# Altium schematic sheet mcu.SchDoc
size A3; SheetNumber: 2; SheetTotal: 8
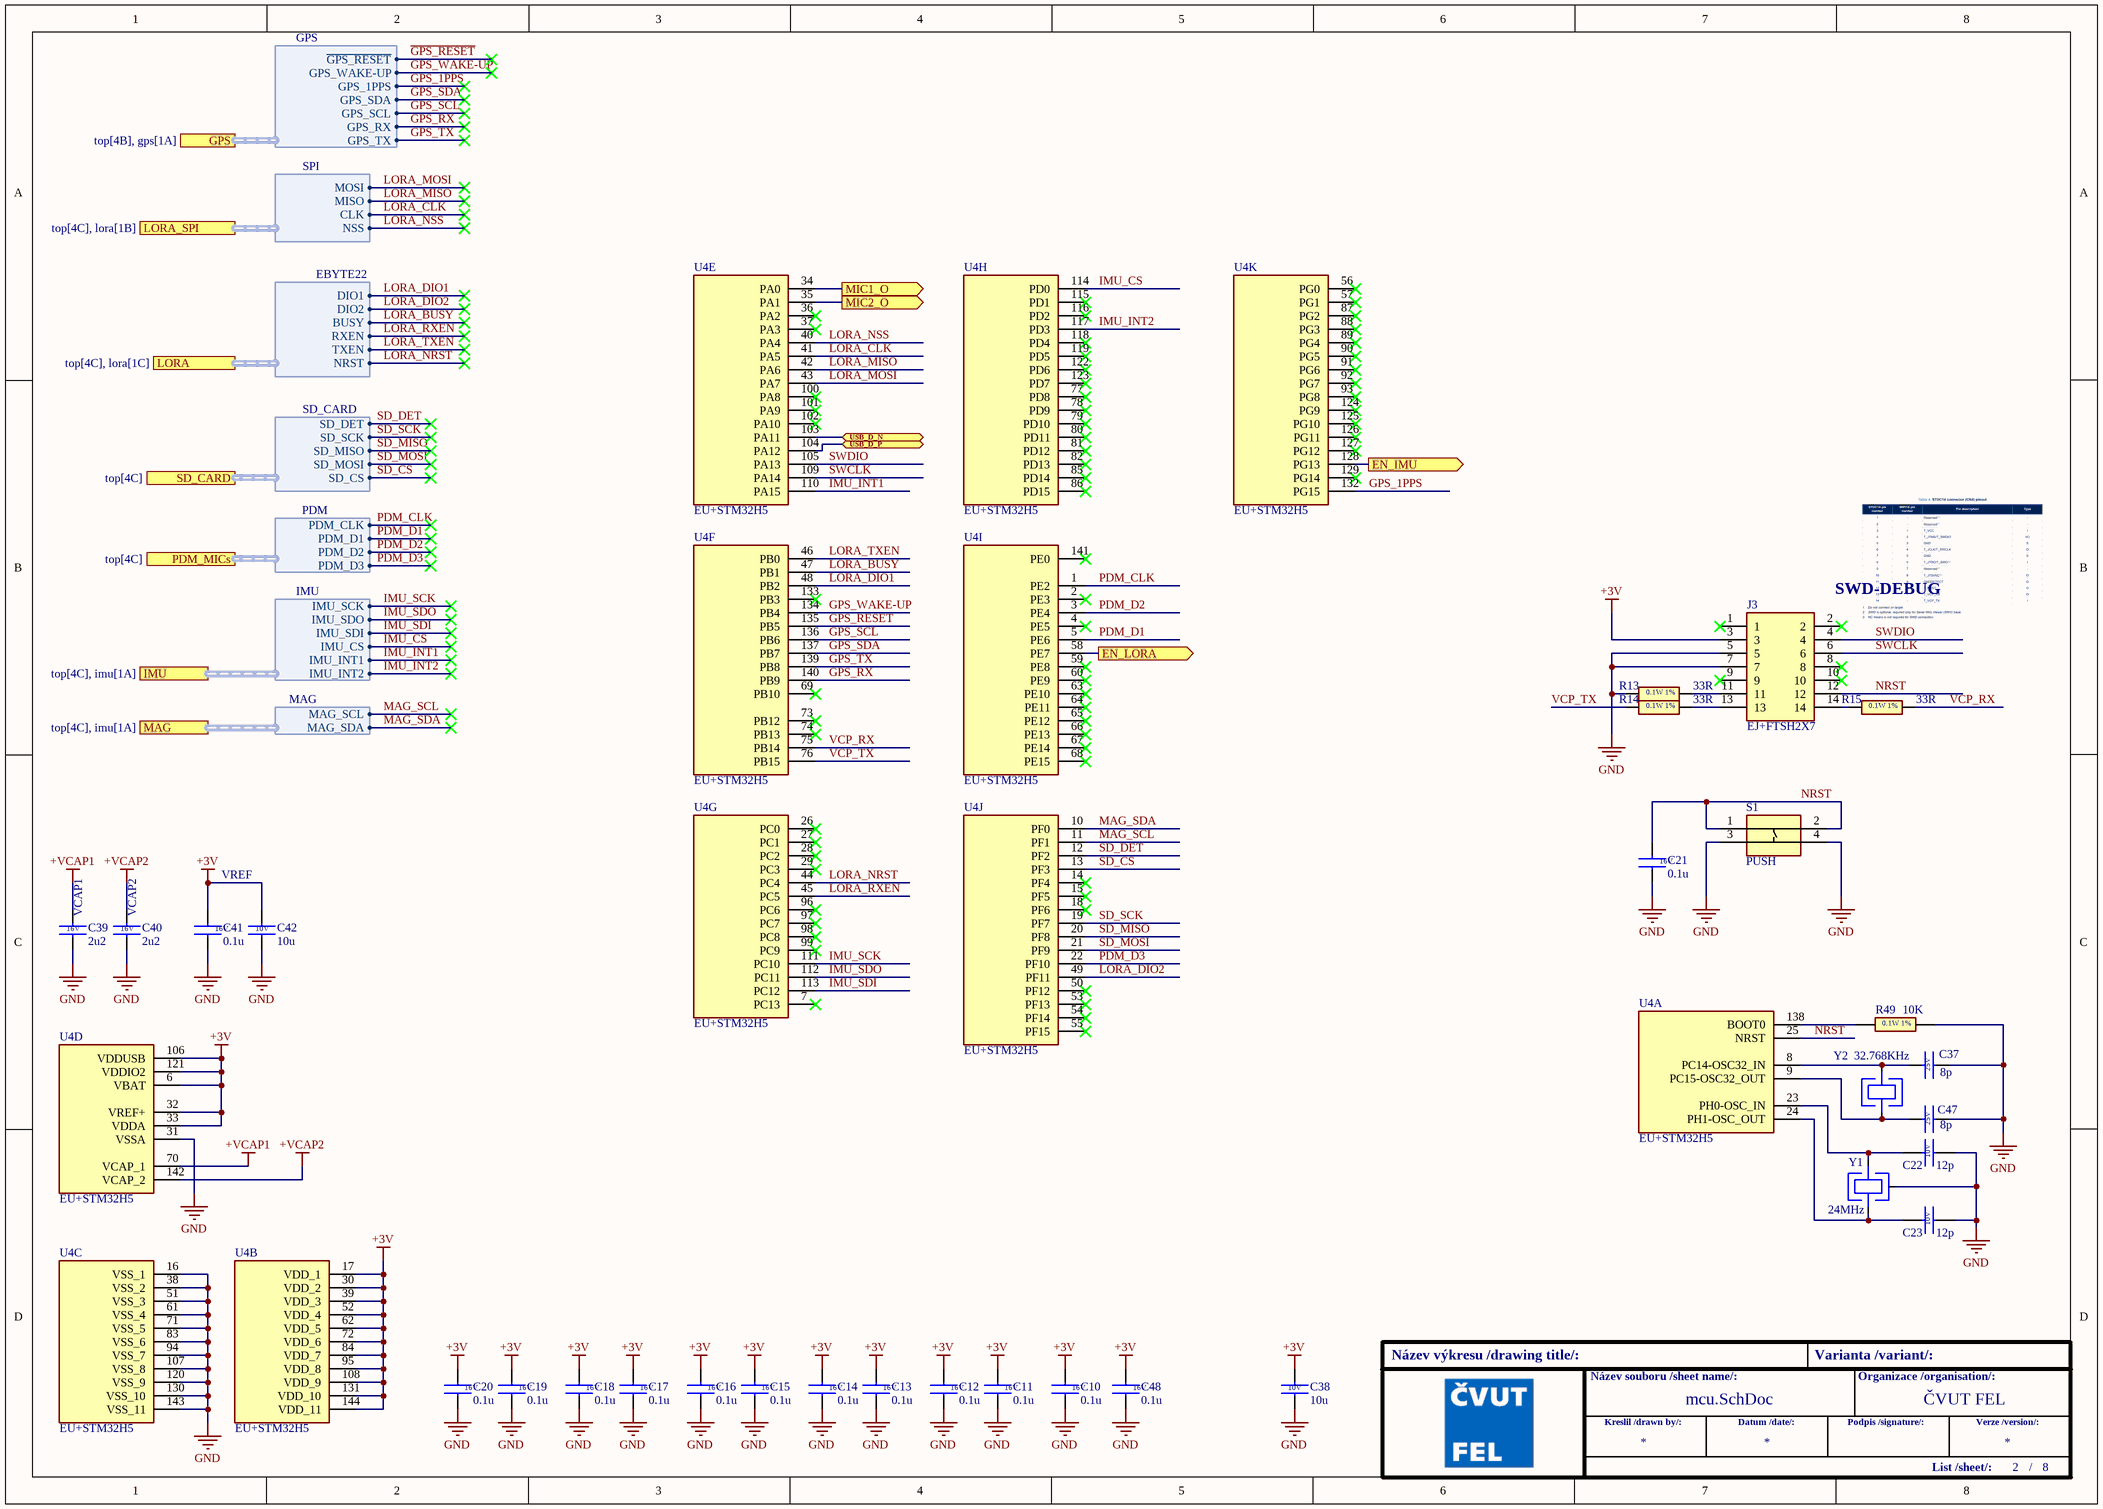
[diagram p0: mcu.SchDoc]

## Parts
C10  0.1u  [CAPC1608X95N]
C11  0.1u  [CAPC1608X95N]
C12  0.1u  [CAPC1608X95N]
C13  0.1u  [CAPC1608X95N]
C14  0.1u  [CAPC1608X95N]
C15  0.1u  [CAPC1608X95N]
C16  0.1u  [CAPC1608X95N]
C17  0.1u  [CAPC1608X95N]
C18  0.1u  [CAPC1608X95N]
C19  0.1u  [CAPC1608X95N]
C20  0.1u  [CAPC1608X95N]
C21  0.1u  [CAPC1608X95N]
C22  12p  [CAPC1608X97N]
C23  12p  [CAPC1608X97N]
C37  8p  [CBR04C160F5GAC]
C38  10u  [C0603]
C39  2u2  [CAPC1608X90N]
C40  2u2  [CAPC1608X90N]
C41  0.1u  [CAPC1608X95N]
C42  10u  [C0603]
C47  8p  [CBR04C160F5GAC]
C48  0.1u  [CAPC1608X95N]
J3  EJ+FTSH2X7  [FTSH-107-XX-YYY-DV-K-A-P]
R13  33R  [RESC1608X55N]
R14  33R  [RESC1608X55N]
R15  33R  [RESC1608X55N]
R49  10K  [RESC1608X50N]
S1  PUSH  [RKB2SJM250SMTRLFS]
U4  EU+STM32H5  [QFP50P2200X2200X160-144N]  (parts A,B,C,D,E,F,G,H,I,J,K of 11)
Y1  24MHz  [830107006509]
Y2  32.768KHz  [830009709]

## Ports
EN_IMU (out, see top[4B], power[3B]), EN_LORA (out, see top[4B], power[3A]), GPS (harness GPS, see top[4B], gps[1A]), IMU (harness IMU, see top[4C], imu[1A]), LORA (harness EBYTE22, see top[4C], lora[1C]), LORA_SPI (harness SPI, see top[4C], lora[1B]), MAG (harness MAG, see top[4C], imu[1A]), MIC1_O (out, see top[4C], analog_mics[3B]), MIC2_O (out, see top[4C], analog_mics[3C]), PDM_MICs (harness PDM, see top[4C]), SD_CARD (harness SD_CARD, see top[4C]), USB_D_N (bidir, see top[4B]), USB_D_P (bidir, see top[4B])

## Harnesses
SPI: MOSI, MISO, CLK, NSS
EBYTE22: BUSY, RXEN, TXEN, NRST, DIO2, DIO1
GPS: GPS_TX, GPS_RX, GPS_SCL, GPS_SDA, GPS_1PPS, GPS_WAKE-UP, ~{GPS_RESET}
SD_CARD: SD_CS, SD_MOSI, SD_SCK, SD_DET, SD_MISO
PDM: PDM_D3, PDM_D2, PDM_D1, PDM_CLK
IMU: IMU_INT2, IMU_INT1, IMU_CS, IMU_SDI, IMU_SDO, IMU_SCK
MAG: MAG_SCL, MAG_SDA

## Nets
+3V: C10.1 C11.1 C12.1 C13.1 C14.1 C15.1 C16.1 C17.1 C18.1 C19.1 C20.1 C38.1 C41.1 C42.1 C48.1 J3.3 U4.6(VBAT) U4.17(VDD_1) U4.30(VDD_2) U4.32(VREF+) U4.33(VDDA) U4.39(VDD_3) U4.52(VDD_4) U4.62(VDD_5) U4.72(VDD_6) U4.84(VDD_7) U4.95(VDD_8) U4.106(VDDUSB) U4.108(VDD_9) U4.121(VDDIO2) U4.131(VDD_10) U4.144(VDD_11)
+VCAP1: C39.1 U4.70(VCAP_1)
+VCAP2: C40.1 U4.142(VCAP_2)
GND: C10.2 C11.2 C12.2 C13.2 C14.2 C15.2 C16.2 C17.2 C18.2 C19.2 C20.2 C21.2 C22.2 C23.2 C37.2 C38.2 C39.2 C40.2 C41.2 C42.2 C47.2 C48.2 J3.5 J3.7 R13.1 R49.2 S1.3(COM) S1.4(COM_2) U4.16(VSS_1) U4.31(VSSA) U4.38(VSS_2) U4.51(VSS_3) U4.61(VSS_4) U4.71(VSS_5) U4.83(VSS_6) U4.94(VSS_7) U4.107(VSS_8) U4.120(VSS_9) U4.130(VSS_10) U4.143(VSS_11) Y1.2(GND)
EN_IMU: U4.128(PG13) ; port EN_IMU
EN_LORA: U4.58(PE7) ; port EN_LORA
~{GPS_RESET}: U4.135(PB5) ; port GPS.~{GPS_RESET}
GPS_1PPS: U4.132(PG15) ; port GPS.GPS_1PPS
GPS_RX: U4.140(PB9) ; port GPS.GPS_RX
GPS_SCL: U4.136(PB6) ; port GPS.GPS_SCL
GPS_SDA: U4.137(PB7) ; port GPS.GPS_SDA
GPS_TX: U4.139(PB8) ; port GPS.GPS_TX
GPS_WAKE-UP: U4.134(PB4) ; port GPS.GPS_WAKE-UP
IMU_CS: U4.114(PD0) ; port IMU.IMU_CS
IMU_INT1: U4.110(PA15) ; port IMU.IMU_INT1
IMU_INT2: U4.117(PD3) ; port IMU.IMU_INT2
IMU_SCK: U4.111(PC10) ; port IMU.IMU_SCK
IMU_SDI: U4.113(PC12) ; port IMU.IMU_SDI
IMU_SDO: U4.112(PC11) ; port IMU.IMU_SDO
LORA_BUSY: U4.47(PB1) ; port LORA.BUSY
LORA_CLK: U4.41(PA5) ; port LORA_SPI.CLK
LORA_DIO1: U4.48(PB2) ; port LORA.DIO1
LORA_DIO2: U4.49(PF11) ; port LORA.DIO2
LORA_MISO: U4.42(PA6) ; port LORA_SPI.MISO
LORA_MOSI: U4.43(PA7) ; port LORA_SPI.MOSI
LORA_NRST: U4.44(PC4) ; port LORA.NRST
LORA_NSS: U4.40(PA4) ; port LORA_SPI.NSS
LORA_RXEN: U4.45(PC5) ; port LORA.RXEN
LORA_TXEN: U4.46(PB0) ; port LORA.TXEN
MAG_SCL: U4.11(PF1) ; port MAG.MAG_SCL
MAG_SDA: U4.10(PF0) ; port MAG.MAG_SDA
MIC1_O: U4.34(PA0) ; port MIC1_O
MIC2_O: U4.35(PA1) ; port MIC2_O
NRST: C21.1 J3.12 S1.1(NO_1) S1.2(NO_2) U4.25(NRST)
PDM_CLK: U4.1(PE2) ; port PDM_MICs.PDM_CLK
PDM_D1: U4.5(PE6) ; port PDM_MICs.PDM_D1
PDM_D2: U4.3(PE4) ; port PDM_MICs.PDM_D2
PDM_D3: U4.22(PF10) ; port PDM_MICs.PDM_D3
SD_CS: U4.13(PF3) ; port SD_CARD.SD_CS
SD_DET: U4.12(PF2) ; port SD_CARD.SD_DET
SD_MISO: U4.20(PF8) ; port SD_CARD.SD_MISO
SD_MOSI: U4.21(PF9) ; port SD_CARD.SD_MOSI
SD_SCK: U4.19(PF7) ; port SD_CARD.SD_SCK
SWCLK: J3.6 U4.109(PA14)
SWDIO: J3.4 U4.105(PA13)
USB_D_N: U4.103(PA11) ; port USB_D_N
USB_D_P: U4.104(PA12) ; port USB_D_P
VCP_RX: R15.2 U4.75(PB14)
VCP_TX: R14.1 U4.76(PB15)
NetC22_1: C22.1 U4.23(PH0-OSC_IN) Y1.3(CRYSTAL_2)
NetC23_1: C23.1 U4.24(PH1-OSC_OUT) Y1.1(CRYSTAL_1)
NetC37_1: C37.1 U4.8(PC14-OSC32_IN) Y2.2(CRYSTAL_2)
NetC47_1: C47.1 U4.9(PC15-OSC32_OUT) Y2.1(CRYSTAL_1)
NetJ3_11: J3.11 R13.2
NetJ3_13: J3.13 R14.2
NetJ3_14: J3.14 R15.1
NetR49_1: R49.1 U4.138(BOOT0)

Not connected (* = marked no-connect by the designer): J3 1* 2* 8* 9* 10*; U4 2(PE3)* 4(PE5)* 7(PC13)* 14(PF4)* 15(PF5)* 18(PF6)* 26(PC0)* 27(PC1)* 28(PC2)* 29(PC3)* 36(PA2)* 37(PA3)* 50(PF12)* 53(PF13)* 54(PF14)* 55(PF15)* 56(PG0)* 57(PG1)* 59(PE8)* 60(PE9)* 63(PE10)* 64(PE11)* 65(PE12)* 66(PE13)* 67(PE14)* 68(PE15)* 69(PB10)* 73(PB12)* 74(PB13)* 77(PD8)* 78(PD9)* 79(PD10)* 80(PD11)* 81(PD12)* 82(PD13)* 85(PD14)* 86(PD15)* 87(PG2)* 88(PG3)* 89(PG4)* 90(PG5)* 91(PG6)* 92(PG7)* 93(PG8)* 96(PC6)* 97(PC7)* 98(PC8)* 99(PC9)* 100(PA8)* 101(PA9)* 102(PA10)* 115(PD1)* 116(PD2)* 118(PD4)* 119(PD5)* 122(PD6)* 123(PD7)* 124(PG9)* 125(PG10)* 126(PG11)* 127(PG12)* 129(PG14)* 133(PB3)* 141(PE0)*

## Notes on the sheet
- (near J3) SWD-DEBUG
- (near C39) VCAP1
- (near C40) VCAP2
- VREF
- Název výkresu /drawing title/:
- Název souboru /sheet name/:
- Varianta /variant/:
- Organizace /organisation/:
- ČVUT FEL
- Kreslil /drawn by/:
- Datum /date/:
- Podpis /signature/:
- List /sheet/:
- Verze /version/:
- /
- (in symbol ECK+2.2u16V) 16V
- (in symbol ECK+8p25V_0402) 25V
- (in symbol ECK+10u10V) 10V
- (in symbol ECK+12p10V) 10V
- (in symbol ECK+100n16V) 16V
- (in symbol ER+10K) 0.1W 1%
- (in symbol ER+33R) 0.1W 1%

## Library data of the parts
C10-C21 C41 C48 = ECK+100n16V: 16V 0.1uF XR7 0603 10%; Manufacturer_Name: KEMET; Manufacturer_Part_Number: C0603C104K4RAC-TU; Datasheet Link: https://connect.kemet.com:7667/gateway/IntelliData-ComponentDocumentation/1.0/download/specsheet/C0603C104K4RACTU; Height: 0.95mm; Mouser Part Number: 80-C0603C104K4RAC; Arrow Part Number: C0603C104K4RAC-TU; Arrow Price/Stock: https://www.arrow.com/en/products/c0603c104k4ractu/kemet-corporation
C22 C23 = ECK+12p10V: Multilayer Ceramic Capacitors MLCC - SMD/SMT 0603 12pF 10volts C0G(N0P) 1%; Manufacturer_Name: Vishay; Manufacturer_Part_Number: VJ0603A120FXQCW1BC; Datasheet Link: https://www.vishay.com/docs/45199/vjcommercialseries.pdf; Height: 0.97mm; Mouser Part Number: 77-VJ0603A120FXQCBC; Mouser Price/Stock: https://www.mouser.com/Search/Refine.aspx?Keyword=77-VJ0603A120FXQCBC; Arrow Part Number: VJ0603A120FXQCW1BC; Arrow Price/Stock: https://www.arrow.com/en/products/vj0603a120fxqcw1bc/vishay
C37 C47 = ECK+8p25V_0402: 25V 8pF C0G 0402 0.25pF; Manufacturer_Name: Yageo Group; Manufacturer_Part_Number: CBR04C809C3GAC; Datasheet Link: https://www.yageogroup.com/content/datasheet/asset/file/KEM_C1030_CBR_SMD; Height: 0.55mm; Mouser Part Number: 80-CBR04C809C3GAC; Mouser Price/Stock: https://www.mouser.co.uk/ProductDetail/KEMET/CBR04C809C3GAC?qs=kpVq%2FgIAs53vwZ%252BGNvfyMA%3D%3D; Arrow Part Number: CBR04C809C3GAC; Arrow Price/Stock: https://www.arrow.com/en/products/cbr04c809c3gac/kemet-corporation?region=nac
C38 C42 = ECK+10u10V: 10 VDC, 20 %, X5R; Manufacturer_Name: KEMET; Manufacturer_Part_Number: C0603C106M8PACTU; Datasheet Link: https://content.kemet.com/datasheets/KEM_C1006_X5R_SMD.pdf; Height: 0.87mm; Mouser Part Number: 80-C0603C106M8PACTU; Mouser Price/Stock: https://www.mouser.co.uk/ProductDetail/KEMET/C0603C106M8PACTU?qs=gt1LBUVyoHk6B7S%252BOYJa0A%3D%3D; Arrow Part Number: C0603C106M8PACTU; Arrow Price/Stock: https://www.arrow.com/en/products/c0603c106m8pactu/kemet-corporation?region=nac
C39 C40 = ECK+2.2u16V: Multilayer Ceramic Capacitors MLCC - SMD/SMT 2.2 uF 16 VDC 10% 0603 X6S; Manufacturer_Name: Murata Electronics; Manufacturer_Part_Number: GRM188C81C225KA12D; Datasheet Link: https://search.murata.co.jp/Ceramy/image/img/A01X/G101/ENG/GRM188C81C225KA12-04A.pdf; Height: 0.9mm; Mouser Part Number: 81-GRM188C81C225KA2D; Mouser Price/Stock: https://www.mouser.co.uk/ProductDetail/Murata-Electronics/GRM188C81C225KA12D?qs=O5cugoO6nwevZQeqg2lgHQ%3D%3D; Arrow Part Number: GRM188C81C225KA12D; Arrow Price/Stock: https://www.arrow.com/en/products/grm188c81c225ka12d/murata-manufacturing?utm_currency=USD&region=nac
J3 = EJ+FTSH2X7: Connector; Manufacturer_Name: SAMTEC; Manufacturer_Part_Number: FTSH-107-01-L-DV-K-A-P; Datasheet Link: http://suddendocs.samtec.com/prints/ftsh-1xx-xx-xxx-dv-xxx-xxx-mkt.pdf; Mouser Part Number: 200-FTSH10701LDVKAP; Mouser Price/Stock: https://www.mouser.co.uk/ProductDetail/Samtec/FTSH-107-01-L-DV-K-A-P?qs=PB6%2FjmICvI2QizANfiVr3Q%3D%3D; Arrow Part Number: FTSH-107-01-L-DV-K-A-P; Arrow Price/Stock: https://www.arrow.com/en/products/ftsh-107-01-l-dv-k-a-p/samtec?region=nac
R13-R15 = ER+33R: Resistor 1% 0.1W; Manufacturer_Name: ROYALOHM; Manufacturer_Part_Number: 0603WAF330JT5E; Datasheet Link: https://datasheet.lcsc.com/lcsc/2206010116_UNI-ROYAL-Uniroyal-Elec-0603WAF330JT5E_C23140.pdf; Height: 0.55mm; Mouser Part Number: 303-0603WAF330JT5E; Mouser Price/Stock: https://www.mouser.co.uk/ProductDetail/Royalohm/0603WAF330JT5E?qs=e8oIoAS2J1RitKiKgULsBA%3D%3D
R49 = ER+10K: Resistor 1%, 0.1W; Manufacturer_Name: Vishay; Manufacturer_Part_Number: CRCW060310K0FKEA; Datasheet Link: http://www.vishay.com/docs/20035/dcrcwe3.pdf; Height: 0.5mm; Mouser Part Number: 71-CRCW0603-10K-E3; Mouser Price/Stock: https://www.mouser.co.uk/ProductDetail/Vishay-Dale/CRCW060310K0FKEA?qs=pAO1Z172M84BVnhDjtnsoQ%3D%3D; Arrow Part Number: CRCW060310K0FKEA; Arrow Price/Stock: https://www.arrow.com/en/products/crcw060310k0fkea/vishay?region=europe
S1 = EB+PUSH2: Small Tact Switch; Manufacturer_Name: C & K COMPONENTS; Manufacturer_Part_Number: RKB2SJM250SMTR LFS; Datasheet Link: https://www.ckswitches.com/media/3130/ck_rk_datasheet.pdf; Height: 2.7mm; Mouser Part Number: 611-RKB2SJM250SMTRLF; Mouser Price/Stock: https://www.mouser.co.uk/ProductDetail/CK/RKB2SJM250SMTR-LFS?qs=iLbezkQI%252Bsj518EgFgehgw%3D%3D; Arrow Part Number: RKB2SJM250SMTR LFS; Arrow Price/Stock: null?region=nac
U4 = EU+STM32H5: STM32H563ZIT6; Manufacturer_Name: STMicroelectronics; Datasheet Link: https://www.st.com/resource/en/datasheet/stm32h562ag.pdf; Height: 1.6mm; Manufacturer_Part_Number: STM32H563ZIT6; Mouser Part Number: 511-STM32H563ZIT6; Mouser Price/Stock: https://www.mouser.co.uk/ProductDetail/STMicroelectronics/STM32H563ZIT6?qs=amGC7iS6iy9kqsV9OIos2w%3D%3D; Arrow Part Number: STM32H563ZIT6; Arrow Price/Stock: https://www.arrow.com/en/products/stm32h563zit6/stmicroelectronics?utm_currency=USD&region=nac
Y1 = ECR+24MHZ: Crystals WE-XTAL 24.0MHz 15ppm 3.2 x 2.5mm; pin to pad: 2>2+4; Manufacturer_Name: Wurth Elektronik; Datasheet Link: https://www.we-online.com/catalog/datasheet/830107006509.pdf; Height: 0.8mm; Manufacturer_Part_Number: 830107006509; Mouser Part Number: 710-830107006509; Mouser Price/Stock: https://www.mouser.co.uk/ProductDetail/Wurth-Elektronik/830107006509?qs=hWgE7mdIu5QkYkvr4tcl2g%3D%3D
Y2 = ECR+32.768KHz: Crystals WE-XTAL 32.768 kHz 7pF 70kOhms; Manufacturer_Name: Wurth Elektronik; Datasheet Link: https://www.we-online.com/catalog/datasheet/830009709.pdf; Height: 0.9mm; Manufacturer_Part_Number: 830009709; Mouser Part Number: 710-830009709; Mouser Price/Stock: https://www.mouser.co.uk/ProductDetail/Wurth-Elektronik/830009709?qs=2WXlatMagcG5opfa%252B%2FO2MQ%3D%3D